# Altium schematic sheet Power.SchDoc
size A4
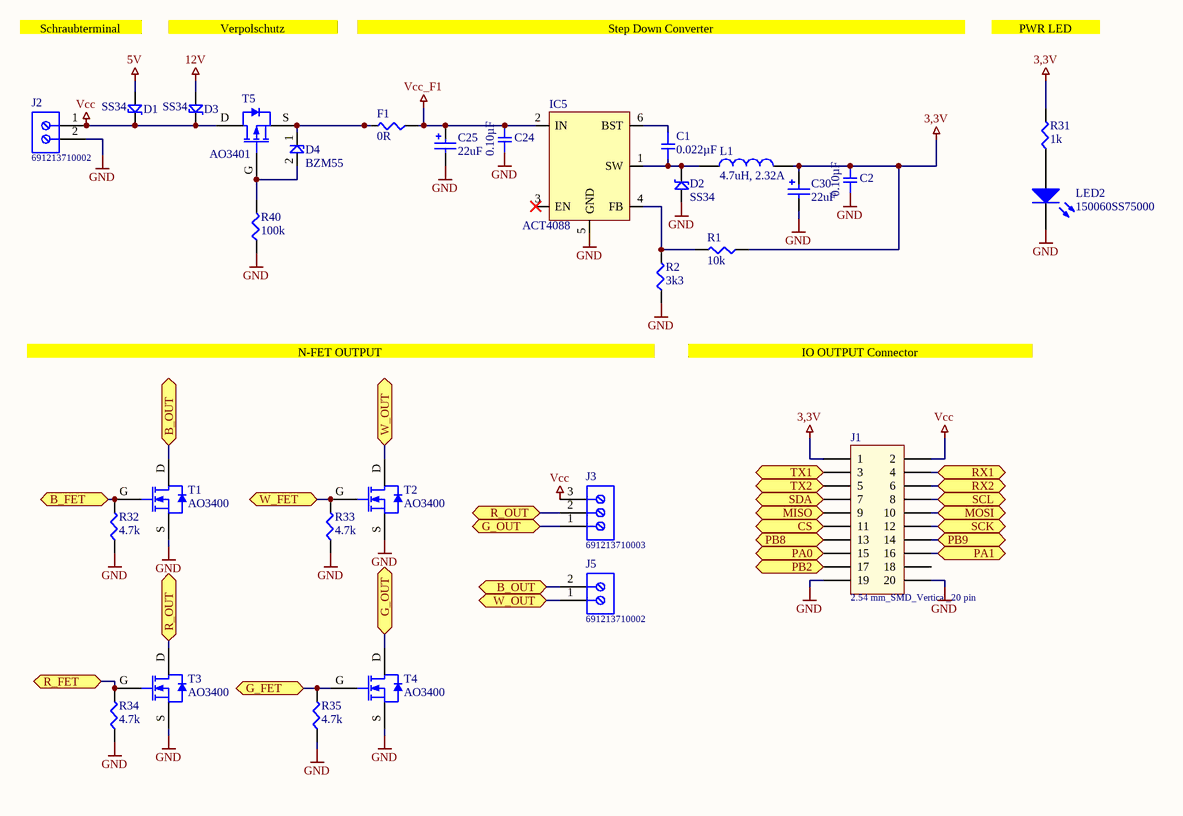
[diagram p0: Power.SchDoc]

## Parts
C1  0.022µF  [SMD-0603C]
C2  0.10µF  [SMD-0603C]
C24  0.10µF  [SMD-0603C]
C25  value 22uF  [WCAP-ASLI_4x5.5]  (hidden comment: 865080140001)
C30  value 22uF  [WCAP-ASLI_4x5.5]  (hidden comment: 865080140001)
D1  SS34  [B240A]
D2  SS34  [B240A]
D3  SS34  [B240A]
D4  BZM55  [SMD-0603-RES]
F1  0R  [SMD-0603-RES]
IC5  ACT4088  [SOT23-6]
J1  2.54 mm_SMD_Vertical_20 pin  [61002021121]
J2  691213710002  [691213710002]
J3  691213710003  [691213710003]
J5  691213710002  [691213710002]
L1  4.7uH, 2.32A  [WE-PD_7332]
LED2  150060SS75000  [0603_A]
R1  10k  [SMD-0603-RES]
R2  3k3  [SMD-0603-RES]
R31  1k  [SMD-0603-RES]
R32  4.7k  [SMD-0603-RES]
R33  4.7k  [SMD-0603-RES]
R34  4.7k  [SMD-0603-RES]
R35  4.7k  [SMD-0603-RES]
R40  100k  [SMD-0603-RES]
T1  AO3400  [SOT23]
T2  AO3400  [SOT23]
T3  AO3400  [SOT23]
T4  AO3400  [SOT23]
T5  AO3401  [SOT23]

## Ports
B_FET (bidir), B_OUT (bidir), CS (bidir), G_FET (bidir), G_OUT (bidir), MISO (bidir), MOSI (bidir), PA0 (bidir), PA1 (bidir), PB2 (bidir), PB8 (bidir), PB9 (bidir), R_FET (bidir), R_OUT (bidir), RX1 (bidir), RX2 (bidir), SCK (bidir), SCL (bidir), SDA (bidir), TX1 (bidir), TX2 (bidir), W_FET (bidir), W_OUT (bidir)

## Nets
3,3V: C2.1 C30.1(P) J1.1 L1.2 R1.1 R31.2
5V: D1.A
12V: D3.A
GND: C2.2 C24.2 C25.2(N) C30.2(N) D2.A IC5.5(GND) J1.19 J1.20 J2.2 LED2.1(K) R2.1 R32.1 R33.1 R34.1 R35.1 R40.1 T1.S T2.S T3.S T4.S
Vcc: D1.K D3.K J1.2 J2.1 J3.3 T5.D
Vcc_F1: C24.1 C25.1(P) F1.1 IC5.2(IN)
B_FET: R32.2 T1.G ; port B_FET
B_OUT: J5.2 T1.D ; port B_OUT
CS: J1.11 ; port CS
G_FET: R35.2 T4.G ; port G_FET
G_OUT: J3.1 T4.D ; port G_OUT
MISO: J1.9 ; port MISO
MOSI: J1.10 ; port MOSI
PA0: J1.15 ; port PA0
PA1: J1.16 ; port PA1
PB2: J1.17 ; port PB2
PB8: J1.13 ; port PB8
PB9: J1.14 ; port PB9
R_FET: R34.2 T3.G ; port R_FET
R_OUT: J3.2 T3.D ; port R_OUT
RX1: J1.4 ; port RX1
RX2: J1.6 ; port RX2
SCK: J1.12 ; port SCK
SCL: J1.8 ; port SCL
SDA: J1.7 ; port SDA
TX1: J1.3 ; port TX1
TX2: J1.5 ; port TX2
W_FET: R33.2 T2.G ; port W_FET
W_OUT: J5.1 T2.D ; port W_OUT
NetC1_1: C1.1 IC5.6(BST)
NetC1_2: C1.2 D2.K IC5.1(SW) L1.1
NetD4_1: D4.1 F1.2 T5.S
NetD4_2: D4.2 R40.2 T5.G
NetIC5_4: IC5.4(FB) R1.2 R2.2
NetLED2_2: LED2.2(A) R31.1

Not connected (* = marked no-connect by the designer): IC5 3(EN)*; J1 18

## Notes on the sheet
- Schraubterminal
- Verpolschutz
- Step Down Converter
- PWR LED
- N-FET OUTPUT
- IO OUTPUT Connector

## Library data of the parts
C1 = GCJ188R71H223KA01D: CAP CER 0.022UF 50V X7R 0603; Manufacturer: Murata Electronics North America; Factory Stock: 0; Unit Price (USD): 0.22; Minimum Quantity: 1; Tolerance: ±10%; Datasheets: http://www.murata.com/~/media/webrenewal/support/library/catalog/products/capacitor/mlcc/c03e.ashx; Image: //media.digikey.com/Renders/Murata%20Renders/0603%28LQG18%29.jpg; Digi-Key Part Number: 490-5851-1-ND; Part Number: GCJ188R71H223KA01D; Quantity Available: 7651; @ qty: 0; Packaging: Cut Tape (CT); Series: GCJ; Part Status: Active; Value: 0.022µF; Voltage: 50V; Temperature Coefficient: X7R; Operating Temperature: -55°C ~ 125°C; Features: Soft Termination; Ratings: AEC-Q200; Applications: Automotive, Boardflex Sensitive; Mounting Type: Surface Mount, MLCC; Package / Case: 0603 (1608 Metric); Size / Dimension: 0.063" L x 0.031" W (1.60mm x 0.80mm); Height - Seated (Max): -; Thickness (Max): 0.031" (0.80mm); Lead Spacing: -; Lead Style: -
C2 C24 = GCM188R71C104KA37J: CAP CER 0.1UF 16V X7R 0603; Manufacturer: Murata Electronics North America; Factory Stock: 0; Unit Price (USD): 0.18; Minimum Quantity: 1; Tolerance: ±10%; Datasheets: http://www.murata.com/~/media/webrenewal/support/library/catalog/products/capacitor/mlcc/c03e.ashx; Image: //media.digikey.com/Renders/Murata%20Renders/0603%28GCM188%29.jpg; Digi-Key Part Number: 490-8015-1-ND; Part Number: GCM188R71C104KA37J; Quantity Available: 17844; @ qty: 0; Packaging: Cut Tape (CT); Series: GCM; Part Status: Active; Value: 0.10µF; Voltage: 16V; Temperature Coefficient: X7R; Operating Temperature: -55°C ~ 125°C; Features: -; Ratings: AEC-Q200; Applications: Automotive; Mounting Type: Surface Mount, MLCC; Package / Case: 0603 (1608 Metric); Size / Dimension: 0.063" L x 0.031" W (1.60mm x 0.80mm); Height - Seated (Max): -; Thickness (Max): 0.035" (0.90mm); Lead Spacing: -; Lead Style: -
C25 C30 = 865080140001: WCAP-ASLI Aluminum Electrolytic Capacitors, size Ф4x5.5mm, 6.3V DC, 22uF; Rated Voltage: 6.3V DC; ComponentLink1Description: Manufacturer; ComponentLink1URL: http://www.we-online.de; ComponentLink2Description: Datasheet; ComponentLink2URL: http://katalog.we-online.de/pbs/datasheet/865080140001.pdf; Part Number: 865080140001; Published Date: June 2017; Publisher: Wurth Elektronik; Size: Ф4x5.5mm; Life Cycle: 2000h; Operating Temperature: -55 °C up to +105 °C
D1-D3 = B240A: Shottkydiode
F1 R1 R2 R31 = ERJ-3EKF1001V: RES SMD 1K OHM 1% 1/10W 0603; Manufacturer: Panasonic Electronic Components; Factory Stock: 0; Unit Price (USD): 0.00379; @ qty: 1500; Minimum Quantity: 1; Power (Watts): 0.1W, 1/10W; Temperature Coefficient: ±100ppm/°C; Part Number: ERJ-3EKF1001V; Datasheets: http://industrial.panasonic.com/www-cgi/jvcr13pz.cgi?E+PZ+3+AOA0002+ERJ3EKF1001V+7+WW; Image: //media.digikey.com/Photos/Panasonic%20Photos/MFG_ERJ-P6W%20Series.jpg; Digi-Key Part Number: P1.00KHCT-ND; Quantity Available: 5218845; Packaging: Cut Tape (CT); Series: ERJ; Part Status: Active; Tolerance: ±1%; Composition: Thick Film; Features: Automotive AEC-Q200; Operating Temperature: -55°C ~ 155°C; Package / Case: 0603 (1608 Metric); Supplier Device Package: 0603; Size / Dimension: 0.063" L x 0.031" W (1.60mm x 0.80mm); Height - Seated (Max): 0.022" (0.55mm); Number of Terminations: 2; Failure Rate: -
  F1: Value: 0R
  R1: Value: 10k
  R2: Value: 3k3
  R31: Value: 1k
J1 = 61002021121: Pin Header WR-PHD, pitch 2.54 mm, SMD, Vertical, dual row, 20 pin; Rated Current: 3 A; Pin Number: 20; Pitch: 2.54 mm; Working Voltage: 250 VAC; Contact Resistance: 20 mOhm; Insulation Resistance: >1000 MOhm; ComponentLink1Description: Manufacturer; ComponentLink1URL: http://www.we-online.de; ComponentLink2Description: Datasheet; ComponentLink2URL: http://katalog.we-online.de/em/datasheet/6100xx21121.pdf; Part Number: 61002021121; Published Date: Jan. 2018; Publisher: Wurth Elektronik; Operating Temperature: -40 to 105 degC; Mounting Technology: SMD; Row Number: Dual; Orientation: Vertical
J2 J5 = 691213710002: Serie 213 - 5.00 mm Horizontal Entry Modular with RisingCage Clamp WR-TBL, 2 pin; Pin Number: 2; Pitch: 5.00 mm; ComponentLink1Description: Manufacturer; ComponentLink1URL: http://www.we-online.de; ComponentLink2Description: Datasheet; ComponentLink2URL: http://katalog.we-online.de/em/datasheet/6912137100xx.pdf; Part Number: 691213710002; Published Date: June 2018; Publisher: Wurth Elektronik; Operating Temperature: -40 to 105 degC; Mounting Technology: THT; Packaging: Box
J3 = 691213710003: Serie 213 - 5.00 mm Horizontal Entry Modular with RisingCage Clamp WR-TBL, 3 pin; Pin Number: 3; Pitch: 5.00 mm; ComponentLink1Description: Manufacturer; ComponentLink1URL: http://www.we-online.de; ComponentLink2Description: Datasheet; ComponentLink2URL: http://katalog.we-online.de/em/datasheet/6912137100xx.pdf; Part Number: 691213710003; Published Date: June 2018; Publisher: Wurth Elektronik; Operating Temperature: -40 to 105 degC; Mounting Technology: THT; Packaging: Box
L1 = 744778004: WE-PD SMT Power Inductor, size 7332, 4.7uH, 2.32A; DC Resistance max.: 60mOhm; Self Resonant Frequency: 45MHz; Saturation Current: 4.2A; ComponentLink1Description: Manufacturer; ComponentLink1URL: http://www.we-online.de; ComponentLink2Description: Datasheet; ComponentLink2URL: https://katalog.we-online.com/pbs/datasheet/744778004.pdf; Part Number: 744778004; Published Date: April 2019; Publisher: Wurth Elektronik; Rated Current: 2.32A; Size: 7332; Inductance: 4.7uH; Operating Temperature: -40 to +125degC; Mounting Technology: SMT; Packaging: Tape and Reel
LED2 = 150060SS75000: SMD mono-color Chip LED, WL-SMCW, Super Red; PackageReference: 0603_A; Color: Super Red; PartNumber: 150060SS75000; ComponentLink1Description: Manufacturer URL; ComponentLink1URL: http://www.we-online.com; ComponentLink2Description: Datasheet; ComponentLink2URL: http://katalog.we-online.com/led/datasheet/150060SS75000.pdf
R32-R35 R40 = ERJ-3EKF4701V: RES SMD 4.7K OHM 1% 1/10W 0603; Manufacturer: Panasonic Electronic Components; Factory Stock: 0; Unit Price (USD): 0.00379; @ qty: 1500; Minimum Quantity: 1; Power (Watts): 0.1W, 1/10W; Temperature Coefficient: ±100ppm/°C; Part Number: ERJ-3EKF4701V; Datasheets: http://industrial.panasonic.com/www-cgi/jvcr13pz.cgi?E+PZ+3+AOA0002+ERJ3EKF4701V+7+WW; Image: //media.digikey.com/Photos/Panasonic%20Photos/MFG_ERJ-P6W%20Series.jpg; Digi-Key Part Number: P4.70KHCT-ND; Quantity Available: 999380; Packaging: Cut Tape (CT); Series: ERJ; Part Status: Active; Tolerance: ±1%; Composition: Thick Film; Features: Automotive AEC-Q200; Operating Temperature: -55°C ~ 155°C; Package / Case: 0603 (1608 Metric); Supplier Device Package: 0603; Size / Dimension: 0.063" L x 0.031" W (1.60mm x 0.80mm); Height - Seated (Max): 0.022" (0.55mm); Number of Terminations: 2; Failure Rate: -
  R32-R35: Value: 4.7k
  R40: Value: 100k
T1-T4 = AO3400: AO3400 MOSFET 30V
T5 = AO3401: AO3401 MOSFET 30V